# Altium schematic sheet kertsen.SchDoc
size A3; SheetNumber: 1; SheetTotal: 1
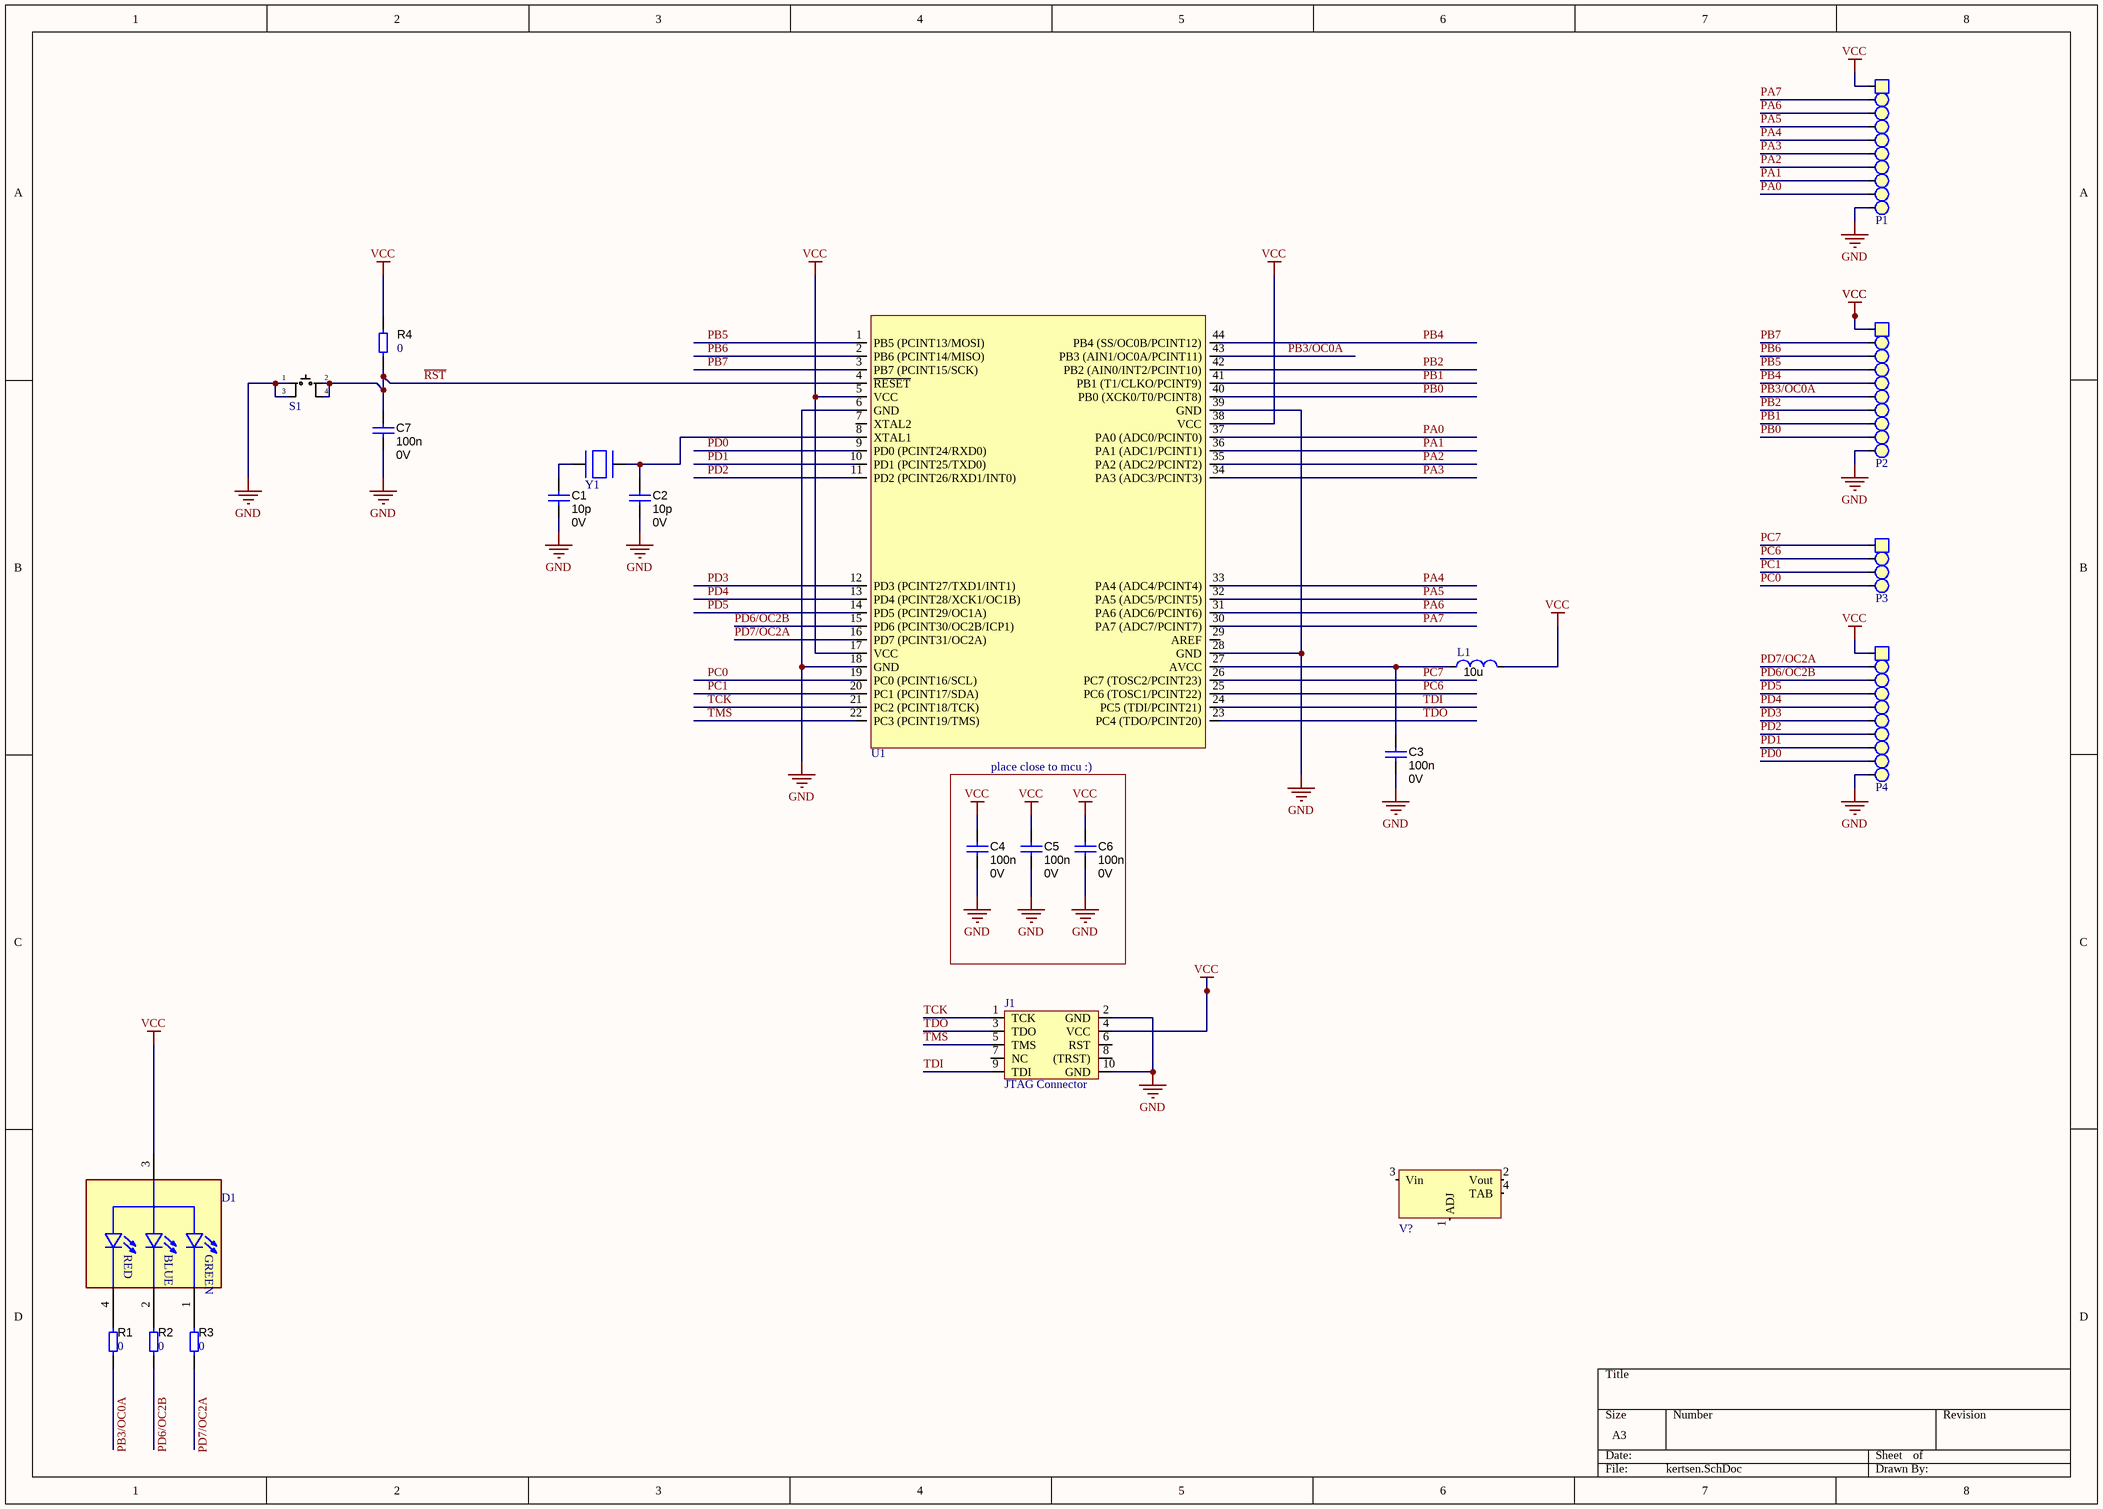
[diagram p0: kertsen.SchDoc]

## Parts
C1  value 10p  VDC: 0V  [1206_180]  (hidden comment: CAP, 1206)
C2  value 10p  VDC: 0V  [1206_180]  (hidden comment: CAP, 1206)
C3  value 100n  VDC: 0V  [1206_180]  (hidden comment: CAP, 1206)
C4  value 100n  VDC: 0V  [1206_180]  (hidden comment: CAP, 1206)
C5  value 100n  VDC: 0V  [1206_180]  (hidden comment: CAP, 1206)
C6  value 100n  VDC: 0V  [1206_180]  (hidden comment: CAP, 1206)
C7  value 100n  VDC: 0V  [1206_180]  (hidden comment: CAP, 1206)
D1  RGB LED  [LED_QBL8RGB60D0-2897]  (value not drawn)
J1  JTAG Connector  [Atmel_JTAG]
L1  value 10u  [INDM2520X190N]  (hidden comment: Inductor, NLFV25T)
P1  1x10 Pin Header  [1x10_PIN_HEADER_2.54MM]  (value not drawn)
P2  1x10 Pin Header  [1x10_PIN_HEADER_2.54MM]  (value not drawn)
P3  1x4 Pin Header  [1x4_PIN_HEADER_2.54MM]  (value not drawn)
P4  1x10 Pin Header  [1x10_PIN_HEADER_2.54MM]  (value not drawn)
R1  value 0  [1206]  (hidden comment: RES, 1206)
R2  value 0  [1206]  (hidden comment: RES, 1206)
R3  value 0  [1206]  (hidden comment: RES, 1206)
R4  value 0  [1206]  (hidden comment: RES, 1206)
S1  Tactile Button  [tacButton smd]  (value not drawn)
U1  ATmega1284  [TQFP-44]  (value not drawn)
V?  LM317  [SOT223]  (value not drawn)
Y1  XTAL-ABM3  [XTAL_ABM3]  (value not drawn)

## Blocks framed on the sheet
place close to mcu :): C4-C6

## Nets
GND: C1.1 C2.2 C3.2 C4.2 C5.2 C6.2 C7.2 J1.2(GND) J1.10(GND) P1.10 P2.10 P4.10 S1.1 S1.3 U1.6(GND) U1.18(GND) U1.28(GND) U1.39(GND)
VCC: C4.1 C5.1 C6.1 D1.3(COMMON_ANODE) J1.4(VCC) L1.1 P1.1 P2.1 P4.1 R4.2 U1.5(VCC) U1.17(VCC) U1.38(VCC)
PA0: P1.9 U1.37(PA0_(ADC0/PCINT0))
PA1: P1.8 U1.36(PA1_(ADC1/PCINT1))
PA2: P1.7 U1.35(PA2_(ADC2/PCINT2))
PA3: P1.6 U1.34(PA3_(ADC3/PCINT3))
PA4: P1.5 U1.33(PA4_(ADC4/PCINT4))
PA5: P1.4 U1.32(PA5_(ADC5/PCINT5))
PA6: P1.3 U1.31(PA6_(ADC6/PCINT6))
PA7: P1.2 U1.30(PA7_(ADC7/PCINT7))
PB0: P2.9 U1.40(PB0_(XCK0/T0/PCINT8))
PB1: P2.8 U1.41(PB1_(T1/CLKO/PCINT9))
PB2: P2.7 U1.42(PB2_(AIN0/INT2/PCINT10))
PB3/OC0A: P2.6 R1.1 U1.43(PB3_(AIN1/OC0A/PCINT11))
PB4: P2.5 U1.44(PB4_(SS/OC0B/PCINT12))
PB5: P2.4 U1.1(PB5_(PCINT13/MOSI))
PB6: P2.3 U1.2(PB6_(PCINT14/MISO))
PB7: P2.2 U1.3(PB7_(PCINT15/SCK))
PC0: P3.4 U1.19(PC0_(PCINT16/SCL))
PC1: P3.3 U1.20(PC1_(PCINT17/SDA))
PC6: P3.2 U1.25(PC6_(TOSC1/PCINT22))
PC7: P3.1 U1.26(PC7_(TOSC2/PCINT23))
PD0: P4.9 U1.9(PD0_(PCINT24/RXD0))
PD1: P4.8 U1.10(PD1_(PCINT25/TXD0))
PD2: P4.7 U1.11(PD2_(PCINT26/RXD1/INT0))
PD3: P4.6 U1.12(PD3_(PCINT27/TXD1/INT1))
PD4: P4.5 U1.13(PD4_(PCINT28/XCK1/OC1B))
PD5: P4.4 U1.14(PD5_(PCINT29/OC1A))
PD6/OC2B: P4.3 R2.1 U1.15(PD6_(PCINT30/OC2B/ICP1))
PD7/OC2A: P4.2 R3.1 U1.16(PD7_(PCINT31/OC2A))
~{RST}: C7.1 R4.1 S1.2 S1.4 U1.4(~{RESET})
TCK: J1.1(TCK) U1.21(PC2_(PCINT18/TCK))
TDI: J1.9(TDI) U1.24(PC5_(TDI/PCINT21))
TDO: J1.3(TDO) U1.23(PC4_(TDO/PCINT20))
TMS: J1.5(TMS) U1.22(PC3_(PCINT19/TMS))
NetC1_2: C1.2 Y1.2
NetC2_1: C2.1 U1.8(XTAL1) Y1.1
NetC3_1: C3.1 L1.2 U1.27(AVCC)
NetD1_1: D1.1(CATHODE_GREEN) R3.2
NetD1_2: D1.2(CATHODE_BLUE) R2.2
NetD1_4: D1.4(CATHODE_RED) R1.2

Not connected (* = marked no-connect by the designer): J1 6(RST) 7(NC) 8((TRST)); U1 7(XTAL2) 29(AREF); V? 1(ADJ) 2(Vout) 3(Vin) 4(TAB)

## Notes on the sheet
- (in symbol RGB LED) RED; BLUE; GREEN

## Library data of the parts
C1-C7 = CAP, 1206: PartNumber: CGA5L1X7R0J226M160AC; TaMin_C: -55°C; TaMax_C: 125°C; ComponentLink1Description: Datasheet link; ComponentLink1URL: https://product.tdk.com/en/search/capacitor/ceramic/mlcc/info?part_no=CGA5L1X7R0J226M160AC
D1 = RGB LED: Lovisas LED
J1 = Atmel JTAG: Atmel JTAG Connector
L1 = Inductor, NLFV25T: Shielded Inductor
P1 P2 P4 = 1x10 Pin Header: 2.54 mm, TH; Value: 1x2 Pin Header
P3 = 1x4 Pin Header: 2.54 mm, TH; Value: 1x2 Pin Header
R1-R4 = RES, 1206: PartNumber: PMR18EZPFV2L00; Power_W: 1W; ComponentLink1Description: Datasheet link; ComponentLink1URL: http://www.rohm.com/web/global/datasheet/PMR18EZPFV/pmr-e
S1 = Tactile Button: Tactile Switch Small Low; Value: Button SMD
U1 = ATmega1284: ATmega1284 - TQFP44; Value: ATmega644PA; Farnell: 2484915
V? = LM317 SOT223: Adjustable Voltage Regulator; Value: LM317; Farnell: 1469023